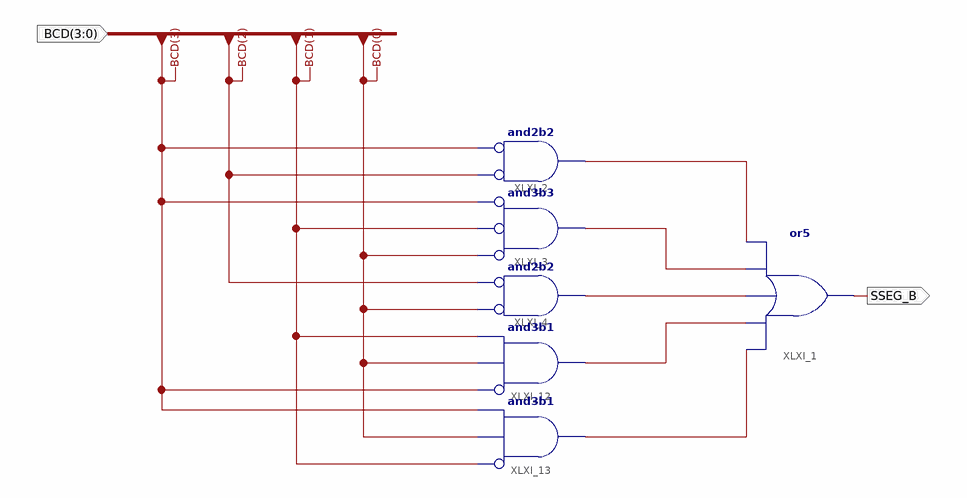
[diagram p0: schematic sheet 1]
// Xilinx ISE schematic SSEG_B.sch (spartan6) as structural Verilog: 6 symbols, 2 ports
module SSEG_B (
  input  [3:0] BCD,
  output SSEG_B
);

  wire XLXN_1, XLXN_2, XLXN_3, XLXN_4, XLXN_5;

  or XLXI_1 (SSEG_B, XLXN_5, XLXN_4, XLXN_1, XLXN_2, XLXN_3);
  and XLXI_2 (XLXN_3, ~BCD[2], ~BCD[3]);  // and2b2
  and XLXI_3 (XLXN_2, ~BCD[0], ~BCD[1], ~BCD[3]);  // and3b3
  and XLXI_4 (XLXN_1, ~BCD[0], ~BCD[2]);  // and2b2
  and XLXI_12 (XLXN_4, ~BCD[3], BCD[0], BCD[1]);  // and3b1
  and XLXI_13 (XLXN_5, ~BCD[1], BCD[0], BCD[3]);  // and3b1
endmodule
